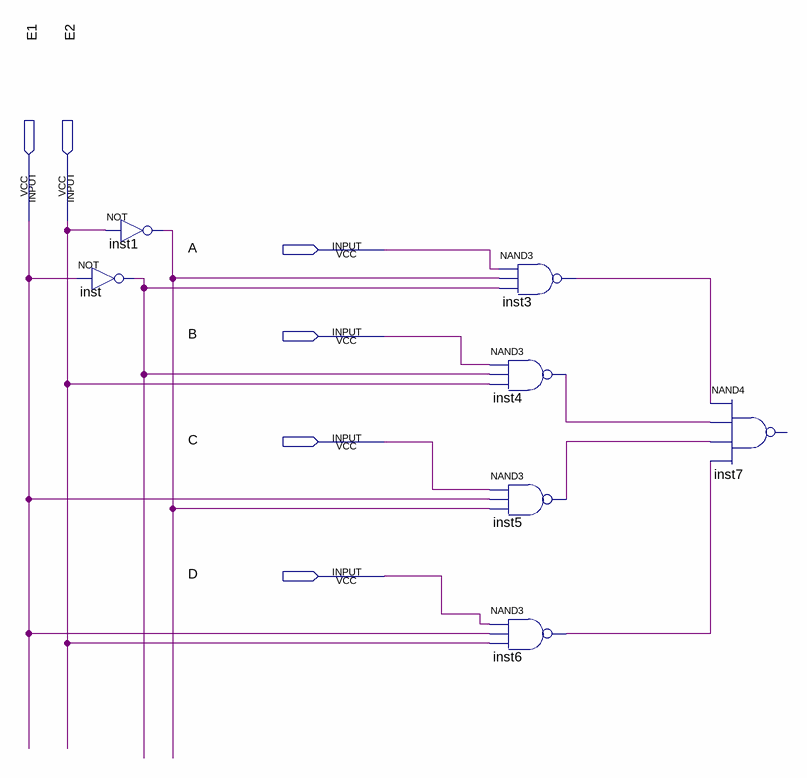
[diagram p0: schematic sheet]
// Quartus schematic 2-1.bdf as structural Verilog: 7 symbols, 6 pins
module \2-1  (
  input  E1,
  input  E2,
  input  A,
  input  B,
  input  C,
  input  D
);

  wire inst1_out, inst3_out, inst4_out, inst5_out, inst6_out, inst_out;

  not inst1 (inst1_out, E2);
  not inst (inst_out, E1);
  nand inst3 (inst3_out, A, inst1_out, inst_out);
  nand inst4 (inst4_out, B, inst_out, E2);
  nand inst5 (inst5_out, C, E1, inst1_out);
  nand inst6 (inst6_out, D, E1, E2);
  // NAND4 inst7 has open pins: IN1=inst3_out, IN2=inst4_out, IN3=inst5_out, IN4=inst6_out, OUT=open
endmodule
